# Altium schematic sheet INPUT_PROTECTION.SchDoc
size A4; SheetNumber: 3; SheetTotal: 27
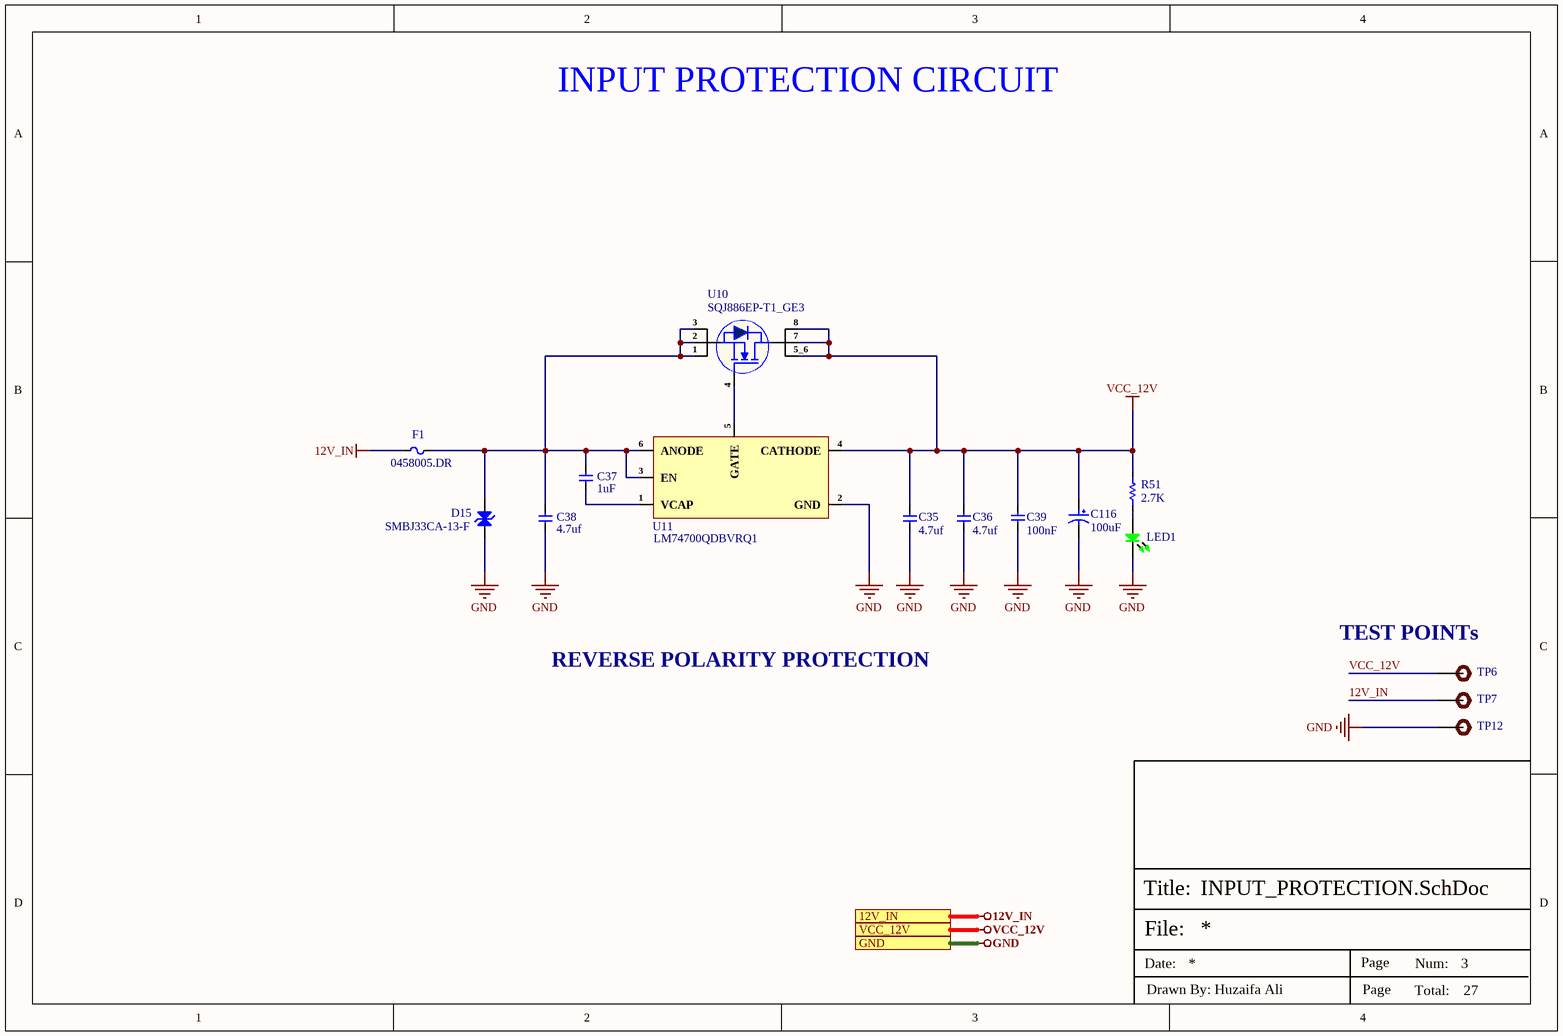
[diagram p0: INPUT_PROTECTION.SchDoc]

## Parts
C35  4.7uf  [Cap-0805]
C36  4.7uf  [Cap-0805]
C37  1uF  [Cap-0402]
C38  4.7uf  [Cap-0805]
C39  100nF  [cap-0402]
C116  100uF  [RVT1H101M0607]
D15  SMBJ33CA-13-F  [SMB Bi Directional]
F1  0458005.DR  [Fuse 1206 (3216 Metric)]
LED1  (no value)  [LED-0603]
R51  2.7K  [Res-0603]
TP6  TEST POINT 0.5mm Dia  [Test-point - 0.5mm]  (value not drawn)  (no BOM)
TP7  TEST POINT 0.5mm Dia  [Test-point - 0.5mm]  (value not drawn)  (no BOM)
TP12  TEST POINT 0.5mm Dia  [Test-point - 0.5mm]  (value not drawn)  (no BOM)
U10  SQJ886EP-T1_GE3  [PowerPAK-SO-8]
U11  LM74700QDBVRQ1  [SOT-23-6]

## Ports
12V_IN (see POWER SECTION[1B], POWER SECTION[3D]), GND (see POWER SECTION[2B], AUDIO_INTERFACE[1D], BUCK REGULATOR[3D], DEBUG_UART_INTERFACE[3D], DIGITAL IO_RELAY_SHEET[5D], DUAL_SIM_INTERFACE[3D], ETHERNET_PHY0[4D], ETHERNET_PHY1[4D], GSM_INTERFACE[2D], HDMI_INTERFACE[3D], LINEAR_VOLTAGE_REG[3D], MICRO_SD_INTERFACE[3D], MIPI-DSI DISPLAY[3D], POWER SECTION[3D], PUSH BUTTONs_INTERFACE[3C], RGB_LEDs_INTERFACE[3D], ROCKCHIP_PWR_SUPPLY[1D], ROCKCHIP_SYSTEM_CONTROL[3C], RS232_RS485_INTERFACE[3C], SENSOR_SHEET[3D], USB2.0_INTERFACE[3D], USB3.0_INTERFACE[3D], USB-C_INTERFACE[2D], WIEGAND_INTERFACE[3D], WIFI_BLUETOOTH_SHEET[4C]), VCC_12V (see POWER SECTION[2B], AUDIO_INTERFACE[1D], BUCK REGULATOR[3D], POWER SECTION[3D], PUSH BUTTONs_INTERFACE[3C], WIEGAND_INTERFACE[3D])

## Nets
12V_IN: F1.2 TP7.1 ; port 12V_IN
GND: C35.1 C36.1 C38.1 C39.2 C116.2 D15.1(A) LED1.2 TP12.1 U11.2(GND) ; port GND
VCC_12V: C35.2 C36.2 C39.1 C116.1 R51.1 TP6.1 U10.5_6(D) U10.7(D) U10.8(D) U11.4(CATHODE) ; port VCC_12V
NetC37_1: C37.1 U11.1(VCAP)
NetC37_2: C37.2 C38.2 D15.2(K) F1.1 U10.1(S) U10.2(S) U10.3(S) U11.3(EN) U11.6(ANODE)
NetLED1_1: LED1.1 R51.2
NetU10_4: U10.4(G) U11.5(GATE)

## Notes on the sheet
- INPUT PROTECTION CIRCUIT
- REVERSE POLARITY PROTECTION
- (near TP6) TEST POINTs
- File:
- Title:
- Date:
- Page
- Num:
- Total:
- Drawn By: Huzaifa Ali

## Library data of the parts
C35 C36 C38 = GRM21BR61H475KE51L: CAP CER 4.7UF 50V X5R 0805; Manufacturer: Murata; Material: Ceramic; Tolerance: 10%; Item Type: Capacitor; Manufacturer Part Number: GRM21BR61H475KE51L; RoHS: Yes; Category: Ceramic Capacitors; Supplier 1: Rs; Stock 1: 37300; Pricing 1: 500=0.09400, 1000=0.08800, 2000=0.08300, 5000=0.07500 (GBP); Mount: Surface Mount; Case/Package: 0805; Case Code (Metric): 2012; Case Code (Imperial): 0805; Min Operating Temperature: -55°C; Max Operating Temperature: 85°C; Capacitance: 4.7uF; Packaging: Tape and Reel; Dielectric: X5R; Voltage Rating: 50V; Voltage Rating (DC): 50V; Series: GRM; Length: 2mm; Width: 0.049inch; Height: 1.25mm; Thickness: 0.055inch; Depth: 1.25mm; Reach SVHC Compliant: Yes; Lead Free: Lead Free; RoHS Compliant: Yes; ComponentLink1URL: http://www.farnell.com/datasheets/2079186.pdf?src-supplier=Farnell; ComponentLink1Description: http://www.farnell.com/datasheets/2079186.pdf?src-supplier=Farnell; ComponentLink2URL: http://components.arrow.com/part/dataview/61084395S454511N2606?src-supplier=Arrow+Electronics; ComponentLink2Description: http://components.arrow.com/part/dataview/61084395S454511N2606?src-supplier=Arrow+Electronics; ComponentLink3URL: http://www.farnell.com/datasheets/2079186.pdf?src-supplier=Element14; ComponentLink3Description: http://www.farnell.com/datasheets/2079186.pdf?src-supplier=Element14; ComponentLink4URL: http://search.murata.co.jp/Ceramy/image/img/A01X/G101/ENG/GRM21BR61H475KE51-01.pdf?src-supplier=Digi-Key; ComponentLink4Description: http://search.murata.co.jp/Ceramy/image/img/A01X/G101/ENG/GRM21BR61H475KE51-01.pdf?src-supplier=Digi-Key; ComponentLink5URL: https://search.murata.co.jp/Ceramy/image/img/A01X/G101/ENG/GRM21BR61H475KE51-01.pdf?src-supplier=Digi-Key; ComponentLink5Description: https://search.murata.co.jp/Ceramy/image/img/A01X/G101/ENG/GRM21BR61H475KE51-01.pdf?src-supplier=Digi-Key; ComponentLink6URL: http://www.farnell.com/datasheets/2079186.pdf?src-supplier=Newark; ComponentLink6Description: http://www.farnell.com/datasheets/2079186.pdf?src-supplier=Newark; Supplier Part Number 1: 1138707P; LCSC Part Number: C162420
C37 = CC0402KRX5R8BB105: CAP CER 1UF 25V X5R 0402; Manufacturer: Yageo; Tolerance: 10%; Supplier 1: Mouser; Manufacturer Part Number: CC0402KRX5R8BB105; RoHS: Yes; Category: Ceramic Capacitors; Stock 1: 91975; Pricing 1: 1=0.30000, 10=0.20400, 50=0.20400, 100=0.11600, 1000=0.07200, 10000=0.05900 (USD); Mount: Surface Mount; Case/Package: 0402; Case Code (Metric): 1005; Case Code (Imperial): 0402; Weight: 2.3E-05oz; Min Operating Temperature: -55°C; Max Operating Temperature: 85°C; Packaging: Tape and Reel; Capacitance: 1uF; Voltage Rating: 25V; Dielectric: X5R; Termination: SMD/SMT; Voltage Rating (DC): 25V; Package Quantity: 10000; Length: 0.039inch; Width: 0.02inch; Thickness: 0.022inch; Lead Free: Lead Free; Halogen Free: Halogen Free; RoHS Compliant: Yes; ComponentLink1URL: http://www.mouser.com/ds/2/447/Yageo_UPY-GP_NP0_16V-to-50V_9-358835.pdf?src-supplier=Mouser; ComponentLink1Description: http://www.mouser.com/ds/2/447/Yageo_UPY-GP_NP0_16V-to-50V_9-358835.pdf?src-supplier=Mouser; ComponentLink2URL: http://www.yageo.com/documents/recent/UPY-GPHC_X5R_4V-to-50V_25.pdf?src-supplier=Digi-Key; ComponentLink2Description: http://www.yageo.com/documents/recent/UPY-GPHC_X5R_4V-to-50V_25.pdf?src-supplier=Digi-Key; ComponentLink3URL: https://4donline.ihs.com/images/VipMasterIC/IC/YAGO/YAGO-S-A0006851646/YAGO-S-A0006851646-1.pdf?hkey=6D3A4C79FDBF58556ACFDE234799DDF0&src-supplier=Newark; ComponentLink3Description: https://4donline.ihs.com/images/VipMasterIC/IC/YAGO/YAGO-S-A0006851646/YAGO-S-A0006851646-1.pdf?hkey=6D3A4C79FDBF58556ACFDE234799DDF0&src-supplier=Newark; Supplier Part Number 1: 603-CC402KRX5R8BB105; LCSC Part Number: C326568
C39 = C1005X7R1H104KT000F: CAP CER 0.1UF 50V X7R 0402; Manufacturer: TDK; Tolerance: 10%; Voltage: 25V; Item Type: Capacitor; Supplier 1: Avnet; Manufacturer Part Number: C1005X7R1H104KT000F; RoHS: No; Category: Ceramic Capacitors; Dielectric: X7R; Supplier Part Number 1: C1005X7R1H104KT000F; LCSC Part Number: C361198; ComponentLink1Description: LCSC; ComponentLink1URL: https://www.lcsc.com/product-detail/Multilayer-Ceramic-Capacitors-MLCC-SMD-SMT_TDK-C1005X7R1H104KT000F_C361198.html
C116 = RVT1H101M0607: 100uF 50V ±20% SMD,D6.3xL7.7mm Aluminum Electrolytic Capacitors - SMD ROHS; Manufacturer: ROQANG; Manufacturer Part Number: RVT1H101M0607; Package: SMD,D6.3xL7.7mm; LCSC Part Number: C3151829; Item Type: Capacitor; ComponentLink1Description: LCSC; ComponentLink1URL: https://www.lcsc.com/product-detail/Aluminum-Electrolytic-Capacitors-SMD_ROQANG-RVT1H101M0607_C3151829.html
D15 = SMBJ33CA-13-F: TVS DIODE 33VWM 53.3VC SMB; Manufacturer: Diodes; Supplier: Future Electronics; Supplier Part Number: 2822294; Manufacturer Part Number: SMBJ33CA-13-F; RoHS: Yes; Category: TVS Diodes; Stock: 33000; Pricing: 3000=0.0754, 9000=0.0725, 15000=0.0712, 30000=0.0695, 60000=0.0668 (USD); ComponentLink1URL: https://datasheet.ciiva.com/335/ds19002-335120.pdf?src-supplier=Avnet; ComponentLink1Description: https://datasheet.ciiva.com/335/ds19002-335120.pdf?src-supplier=Avnet; ComponentLink2URL: https://datasheet.ciiva.com/15143/getdatasheetpartid-139973-15143680.pdf?src-supplier=Verical; ComponentLink2Description: https://datasheet.ciiva.com/15143/getdatasheetpartid-139973-15143680.pdf?src-supplier=Verical; ComponentLink3URL: https://datasheet.ciiva.com/16353/ds19002-16353960.pdf?src-supplier=Future+Electronics; ComponentLink3Description: https://datasheet.ciiva.com/16353/ds19002-16353960.pdf?src-supplier=Future+Electronics; LCSC Part Number: C135068; Item Type: Diode
F1 = 0458005.DR: FUSE BRD MNT 5A 32VAC 75VDC 1206; Manufacturer: Littelfuse; Supplier: Rs; Supplier Part Number: 1740294; Manufacturer Part Number: 0458005.DR; RoHS: Yes; Category: Fuses; Stock: 1005; Pricing: 1=0.6241, 10=0.73892, 25=0.71895, 50=0.70003 (GBP); ComponentLink1URL: https://datasheet.ciiva.com/1730/337915-1730547.pdf?src-supplier=Newark; ComponentLink1Description: https://datasheet.ciiva.com/1730/337915-1730547.pdf?src-supplier=Newark; ComponentLink2URL: https://datasheet.ciiva.com/7991/337915-7991910.pdf?src-supplier=Element14; ComponentLink2Description: https://datasheet.ciiva.com/7991/337915-7991910.pdf?src-supplier=Element14; ComponentLink3URL: https://datasheet.ciiva.com/299/littelfuse-fuse-458-series-299786.pdf?src-supplier=Digikey; ComponentLink3Description: https://datasheet.ciiva.com/299/littelfuse-fuse-458-series-299786.pdf?src-supplier=Digikey; ComponentLink4URL: https://datasheet.ciiva.com/299/littelfuse-fuse-458-series-299787.pdf?src-supplier=Digikey; ComponentLink4Description: https://datasheet.ciiva.com/299/littelfuse-fuse-458-series-299787.pdf?src-supplier=Digikey; ComponentLink5URL: https://datasheet.ciiva.com/299/littelfuse-fuse-458-series-299788.pdf?src-supplier=Digikey; ComponentLink5Description: https://datasheet.ciiva.com/299/littelfuse-fuse-458-series-299788.pdf?src-supplier=Digikey; LCSC Part Number: C187561; Item Type: Fuse
LED1 = NCD0603G2: Emerald 0603 Light Emitting Diodes (LED) ROHS; Manufacturer: Foshan NationStar Optoelectronics; Manufacturer Part Number: NCD0603G2; Package: 0603; LCSC Part Number: C87326; Item Type: LED; ComponentLink1Description: LCSC; ComponentLink1URL: https://www.lcsc.com/product-detail/Light-Emitting-Diodes-LED_Foshan-NationStar-Optoelectronics-NCD0603G2_C87326.html
R51 = RC0603FR-072K7L: RES 2.7K OHM 1% 1/10W 0603; Manufacturer: Yageo; Resistance: 2.7kR; Voltage Rating (DC): 50V; Temperature Coefficient: 100ppm/°C; Power Rating: 100mW; Item Type: Resistor; Manufacturer Part Number: RC0603FR-072K7L; RoHS: Yes; Category: Chip SMD Resistors; Supplier 1: Avnet; Stock 1: 5000; Pricing 1: 5000=0.00133, 10000=0.00131, 20000=0.00127 (USD); Case/Package: 0603; Number of Pins: 2; Case Code (Imperial): 0603; Case Code (Metric): 1608; Size Code: 0603; Min Operating Temperature: -55°C; Max Operating Temperature: 155°C; Tolerance: 1%; Packaging: Tape and Reel; Resistor Type: Thick Film; Voltage Rating: 50V; Package Quantity: 1; Termination: SMD/SMT; Number of Terminations: 2; Max Power Dissipation: 100mW; Features: Moisture Resistant; Series: RC; Resistance Tolerance: 1%; Construction: Rectangular; Length: 0.063inch; Width: 0.031inch; Height: 0.022inch; Depth: 0.8mm; Reach SVHC Compliant: Yes; Lead Free: Lead Free; Military Standard: Not; RoHS Compliant: Yes; Supplier Part Number 1: RC0603FR-072K7L; LCSC Part Number: C114612
TP6 TP7 TP12 = TEST POINT 0.5mm Dia: Test Point ON; Item Type: Test Point; Manufacturer Part Number: TEST POINT 0.5mm Dia
U10 = SQJ886EP-T1_GE3: MOSFET N-CH 40V 60A PPAK SO-8; Manufacturer: Vishay Siliconix; Item Type: IC; Supplier: Mouser; Supplier Part Number: 781-SQJ886EP-T1_GE3; Manufacturer Part Number: SQJ886EP-T1_GE3; RoHS: Yes; Category: MOSFETs; Stock: 59592; Pricing: 1=1.5, 10=1.24, 50=1.24, 100=0.959, 1000=0.662, 10000=0.565 (USD); ComponentLink1URL: https://datasheet.ciiva.com/28599/1760631-28599527.pdf?src-supplier=Element14; ComponentLink1Description: https://datasheet.ciiva.com/28599/1760631-28599527.pdf?src-supplier=Element14; ComponentLink2URL: https://datasheet.ciiva.com/30021/sqj886ep-30021665.pdf?src-supplier=Avnet; ComponentLink2Description: https://datasheet.ciiva.com/30021/sqj886ep-30021665.pdf?src-supplier=Avnet; LCSC Part Number: C727822
U11 = LM74700QDBVRQ1: OR Controller N+1 ORing Controller N-Channel 1:1 SOT-23-6; Manufacturer: Texas Instruments; Max Output current: 5A; Turn-On Delay Time: 1.4us; Turn-Off Delay Time: 450ns; Max Supply Voltage: 65V; Min Supply Voltage: 3.2V; Nominal Supply Current: 80uA; Number of Outputs: 1NUMBER; Item Type: IC; Supplier: Mouser; Supplier Part Number: 595-LM74700QDBVRQ1; Manufacturer Part Number: LM74700QDBVRQ1; RoHS: Yes; Category: Power Management ICs; Stock: 11505; Pricing: 1=1.78, 10=1.6, 50=1.6, 100=1.28, 1000=0.877, 10000=0.756 (USD); Mounting Technology: Surface Mount; Case/Package: SOT-23-6; Pins: 6NUMBER; Min Operating Temperature: -40°C; Max Operating Temperature: 125°C; Series: Automotive, AEC-Q100; Length: 2.9mm; Width: 1.6mm; Height: 1.45mm; Thickness: 1.2mm; RoHS Compliant: Yes; ComponentLink1URL: http://www.ti.com/general/docs/suppproductinfo.tsp?distId=10&amp;gotoUrl=http%3A%2F%2Fwww.ti.com%2Flit%2Fgpn%2Flm74700-q1&src-supplier=Digikey; ComponentLink1Description: http://www.ti.com/general/docs/suppproductinfo.tsp?distId=10&amp;gotoUrl=http%3A%2F%2Fwww.ti.com%2Flit%2Fgpn%2Flm74700-q1&src-supplier=Digikey; LCSC Part Number: C2941042